# Altium schematic sheet MCU Sup.SchDoc
size 297 x 209 mm; SheetNumber: 1; SheetTotal: 3
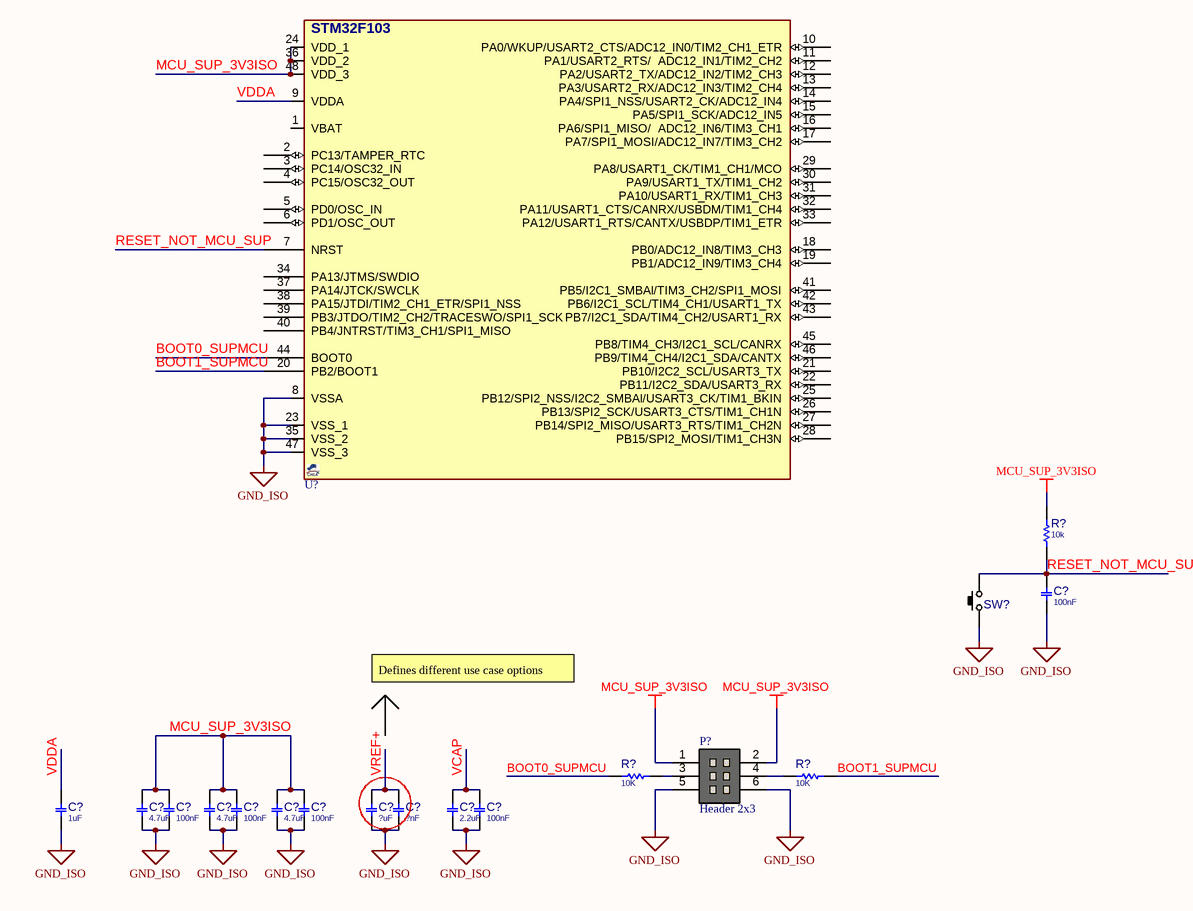
[diagram p0: MCU Sup.SchDoc]

## Parts
(Parts that share a designator on the sheet are numbered #1, #2 ... from top to bottom, then left to right.)
C?#1  100nF  [C0603]
C?#2  1uF  [C0805]
C?#3  4.7uF  [C0805]
C?#4  100nF  [C0603]
C?#5  4.7uF  [C0805]
C?#6  100nF  [C0603]
C?#7  4.7uF  [C0805]
C?#8  100nF  [C0805]
C?#9  ?uF  [C0805]
C?#10  ?nF  [C0603]
C?#11  2.2uF  [C0805]
C?#12  100nF  [C0603]
P?  Header 2x3  [HDR 2X3]
R?#1  10k  [R0603]
R?#2  10K  [R0603]
R?#3  10K  [R0603]
SW?  PUSHBUTTON  [SWPBS_SPST_6X3X5]  (value not drawn)
U?  STM32F103  [QFG50_48]  (value not drawn)

## Nets
GND_ISO: C?#1.2 C?#2.2 C?#3.2 C?#4.2 C?#5.2 C?#6.2 C?#7.2 C?#8.2 C?#9.2 C?#10.2 C?#11.2 C?#12.2 P?.5 P?.6 SW?.1(P1) U?.8(VSSA) U?.23(VSS_1) U?.35(VSS_2) U?.47(VSS_3)
MCU_SUP_3V3ISO: C?#3.1 C?#4.1 C?#5.1 C?#6.1 C?#7.1 C?#8.1 P?.1 P?.2 R?#1.2 U?.24(VDD_1) U?.36(VDD_2) U?.48(VDD_3)
BOOT0_SUPMCU: R?#2.1 U?.44(BOOT0)
BOOT1_SUPMCU: R?#3.2 U?.20(PB2/BOOT1)
RESET_NOT_MCU_SUP: C?#1.1 R?#1.1 SW?.2(P3) U?.7(NRST)
VCAP: C?#11.1 C?#12.1
VDDA: C?#2.1 U?.9(VDDA)
VREF+: C?#9.1 C?#10.1
NetP?_3: P?.3 R?#2.2
NetP?_4: P?.4 R?#3.1

Not connected (* = marked no-connect by the designer): U? 1(VBAT) 2(PC13/TAMPER_RTC) 3(PC14/OSC32_IN) 4(PC15/OSC32_OUT) 5(PD0/OSC_IN) 6(PD1/OSC_OUT) 10(PA0/WKUP/USART2_CTS/ADC12_IN0/TIM2_CH1_ETR) 11(PA1/USART2_RTS/__ADC12_IN1/TIM2_CH2) 12(PA2/USART2_TX/ADC12_IN2/TIM2_CH3) 13(PA3/USART2_RX/ADC12_IN3/TIM2_CH4) 14(PA4/SPI1_NSS/USART2_CK/ADC12_IN4) 15(PA5/SPI1_SCK/ADC12_IN5) 16(PA6/SPI1_MISO/__ADC12_IN6/TIM3_CH1) 17(PA7/SPI1_MOSI/ADC12_IN7/TIM3_CH2) 18(PB0/ADC12_IN8/TIM3_CH3) 19(PB1/ADC12_IN9/TIM3_CH4) 21(PB10/I2C2_SCL/USART3_TX) 22(PB11/I2C2_SDA/USART3_RX) 25(PB12/SPI2_NSS/I2C2_SMBAl/USART3_CK/TIM1_BKIN) 26(PB13/SPI2_SCK/USART3_CTS/TIM1_CH1N) 27(PB14/SPI2_MISO/USART3_RTS/TIM1_CH2N) 28(PB15/SPI2_MOSI/TIM1_CH3N) 29(PA8/USART1_CK/TIM1_CH1/MCO) 30(PA9/USART1_TX/TIM1_CH2) 31(PA10/USART1_RX/TIM1_CH3) 32(PA11/USART1_CTS/CANRX/USBDM/TIM1_CH4) 33(PA12/USART1_RTS/CANTX/USBDP/TIM1_ETR) 34(PA13/JTMS/SWDIO) 37(PA14/JTCK/SWCLK) 38(PA15/JTDI/TIM2_CH1_ETR/SPI1_NSS) 39(PB3/JTDO/TIM2_CH2/TRACESWO/SPI1_SCK) 40(PB4/JNTRST/TIM3_CH1/SPI1_MISO) 41(PB5/I2C1_SMBAl/TIM3_CH2/SPI1_MOSI) 42(PB6/I2C1_SCL/TIM4_CH1/USART1_TX) 43(PB7/I2C1_SDA/TIM4_CH2/USART1_RX) 45(PB8/TIM4_CH3/I2C1_SCL/CANRX) 46(PB9/TIM4_CH4/I2C1_SDA/CANTX)

## Notes on the sheet
- Defines different use case options
- Drawn
- Name
- Date
- Drawing Title
- Checked
- Drawing No.
- Approved
- Size
- A4
- Ver.
- Rev.
- Sheet
- Of

## Library data of the parts
C?#1 C?#4 C?#6 C?#10 C?#12 = CAP_SMD_MLCC_2.2u50V_0603: CAP, MLCC; MANF_P#: C1005X7R1H104K050BB; MANF: TDK; PARAM: X7R, 10%; DIST#: MOUSER; PARAM2: 50V; ASSEMBLY: ASSEMBLY; PRICE: 1000= 27$; DESC: CAP, MLCC
  C?#1 C?#4 C?#6 C?#12: VALUE: 100nF
  C?#10: VALUE: ?nF
C?#2 C?#3 C?#5 C?#7-C?#9 C?#11 = CAP_SMD_MLCC_2.2u50V_0805: CAP, MLCC; MANF_P#: UMK212ABJ225KG-T; MANF: Taiyo Yuden; PARAM: X5R, 10%; DIST#: MOUSER; PARAM2: 50V; ASSEMBLY: ASSEMBLY; PRICE: 100= 10$; DESC: CAP, MLCC
  C?#2: VALUE: 1uF
  C?#3 C?#5 C?#7: VALUE: 4.7uF
  C?#8: VALUE: 100nF
  C?#9: VALUE: ?uF
  C?#11: VALUE: 2.2uF
R?#1 = RES_SMD_0603: RESISTOR, SMD; PARAM: -W; DESC: DESCRIPTION; DIST#: MOUSER; PARAM2: 1%; MANF_P#: -; MANF: -; ASSEMBLY: ASSEMBLY; PRICE: 100= 0.5$; VALUE: 10k
R?#2 R?#3 = RES_SMD: RESISTOR, SMD; PARAM: -W; DESC: DESCRIPTION; DIST#: MOUSER; PARAM2: 1%; MANF_P#: -; MANF: -; ASSEMBLY: ASSEMBLY; PRICE: 100= 0.5$; VALUE: 10K
SW? = SWPBS_SPST_6X3X5: SWITCH, PUSH BUTTON, TACTILE, SMD, SPST, 6X3.5X5mm; MANF: ALPS; DESC: DESCRIPTION; MANF_P#: SKQMBBE010; VALUE: PUSHBUTTON; ASSEMBLY: ASSEMBLY; PARAM: PARAM; PRICE: PRICE
U? = STM32F103C8T6_QFP48: MCU, STM32 ARM 32-bit, Cortex M3, 64KB FLASH, 20KB SRAM; DESC: CAN, I2C, SPI, USART, USB; MANF: ST; PARAM2: 2~3.6VCC, 72MHz, 2X12Bit ADC; PARAM: 64KB FLASH, 20KB SRAM, -40~85oC; MANF_P#: STM32F103C8T6; PRICE: 6$; VALUE: STM32F103
P? = Header 2x3: ComponentLinkp-URL: https://www.smartw.ir/; DatasheetVersion: 2020